# EAGLE design dp_tsc-v21 (EAGLE 6.6.0)
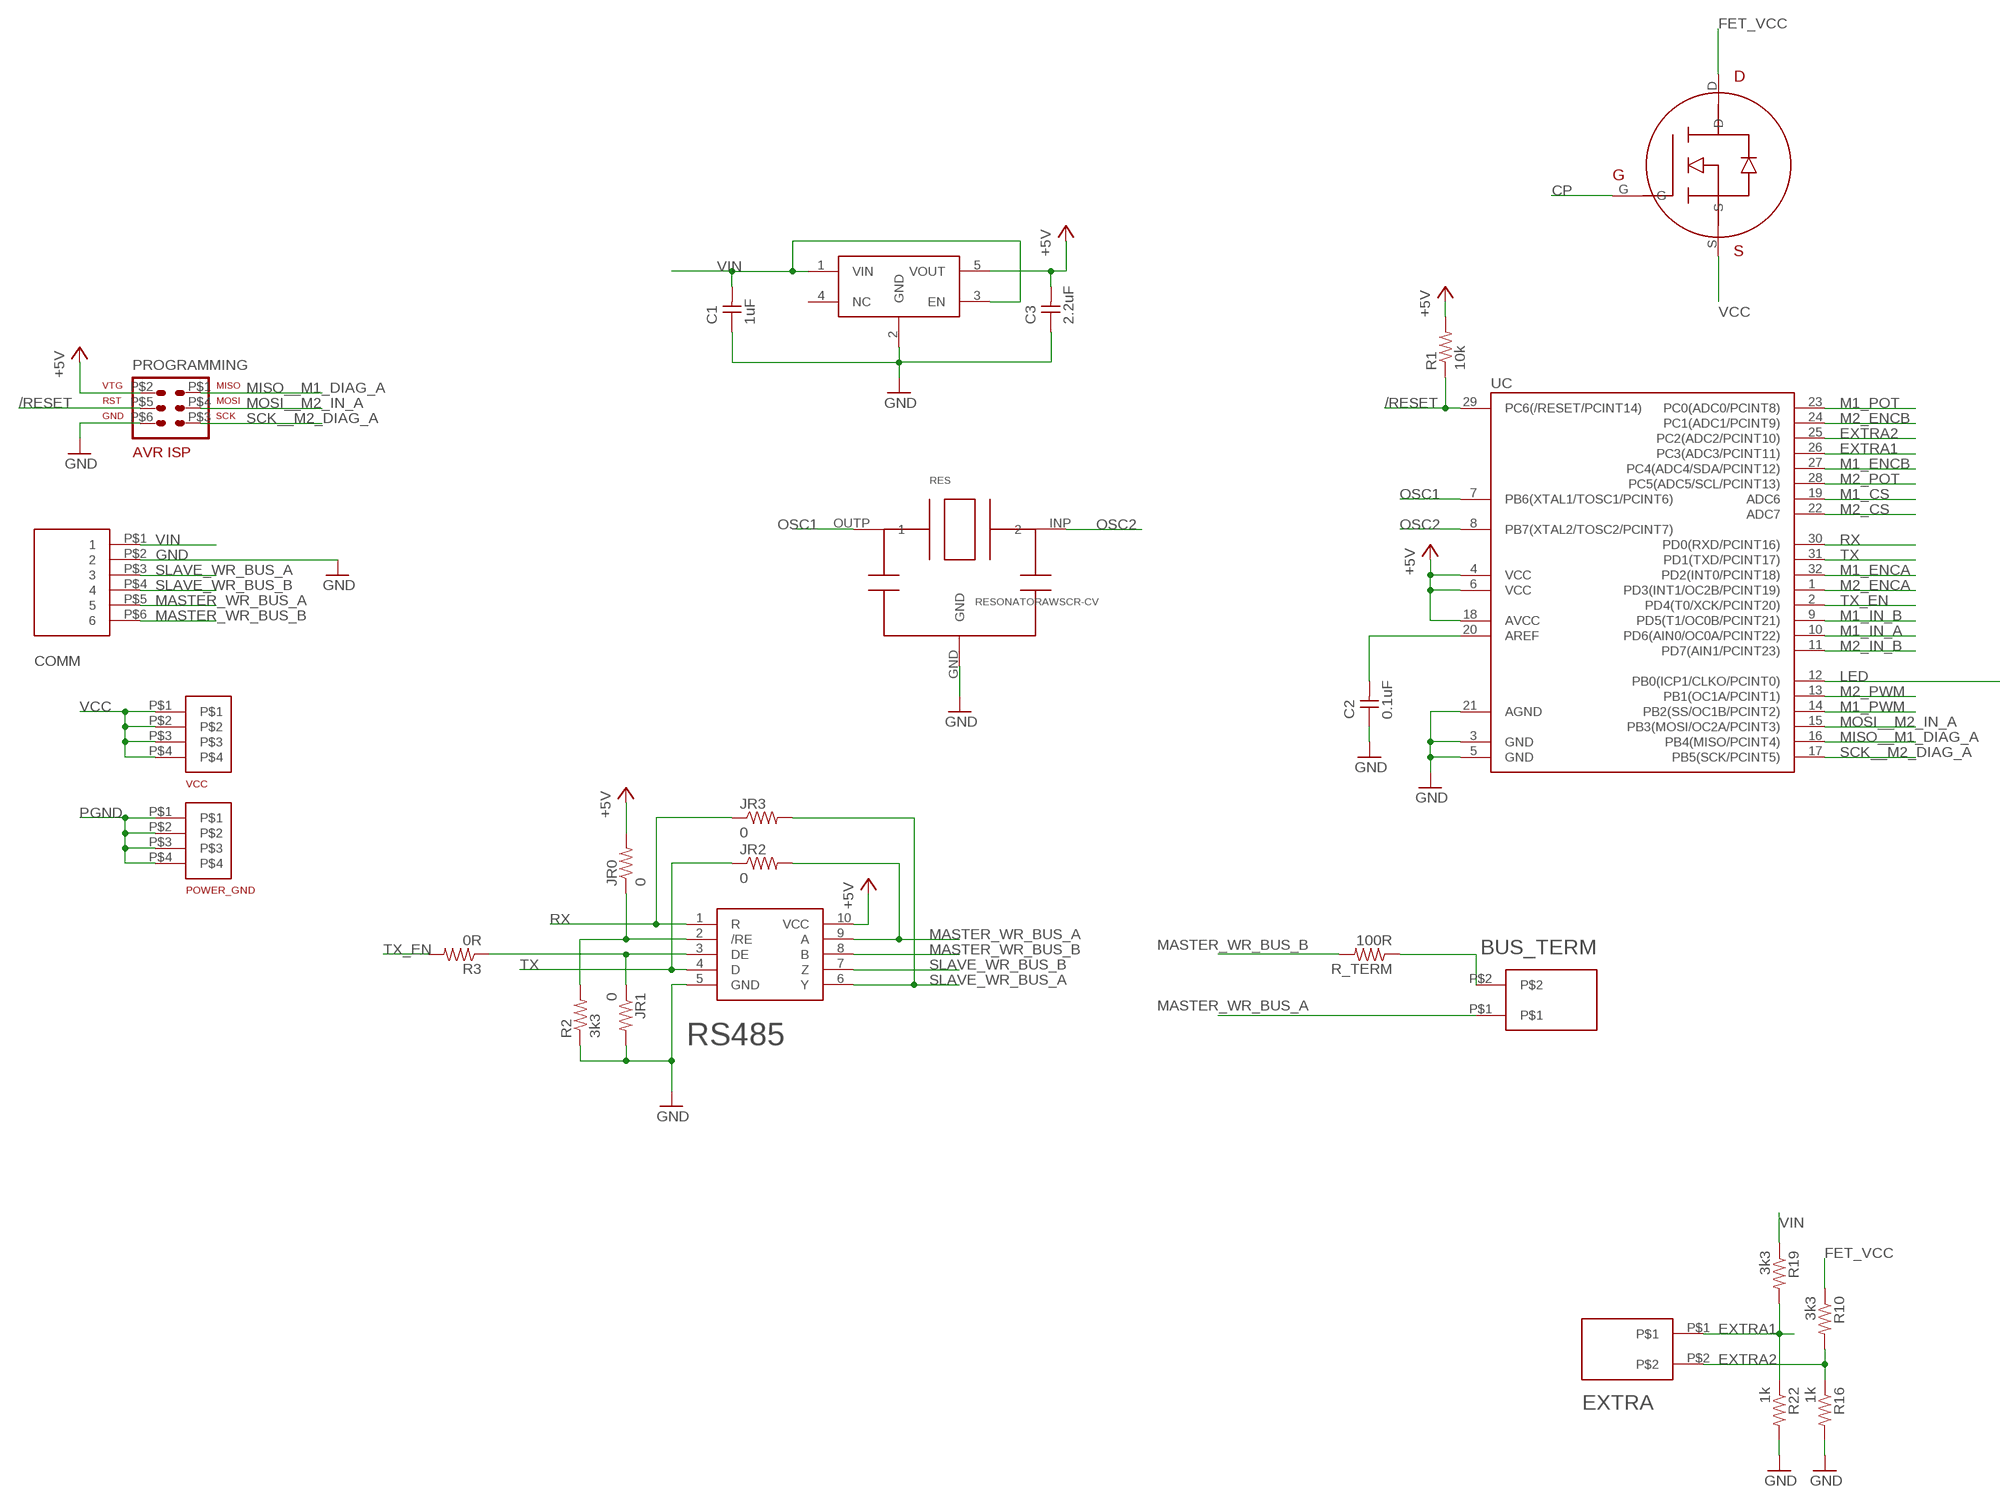
[diagram p0: schematic, sheet 1, part 1 of 2]
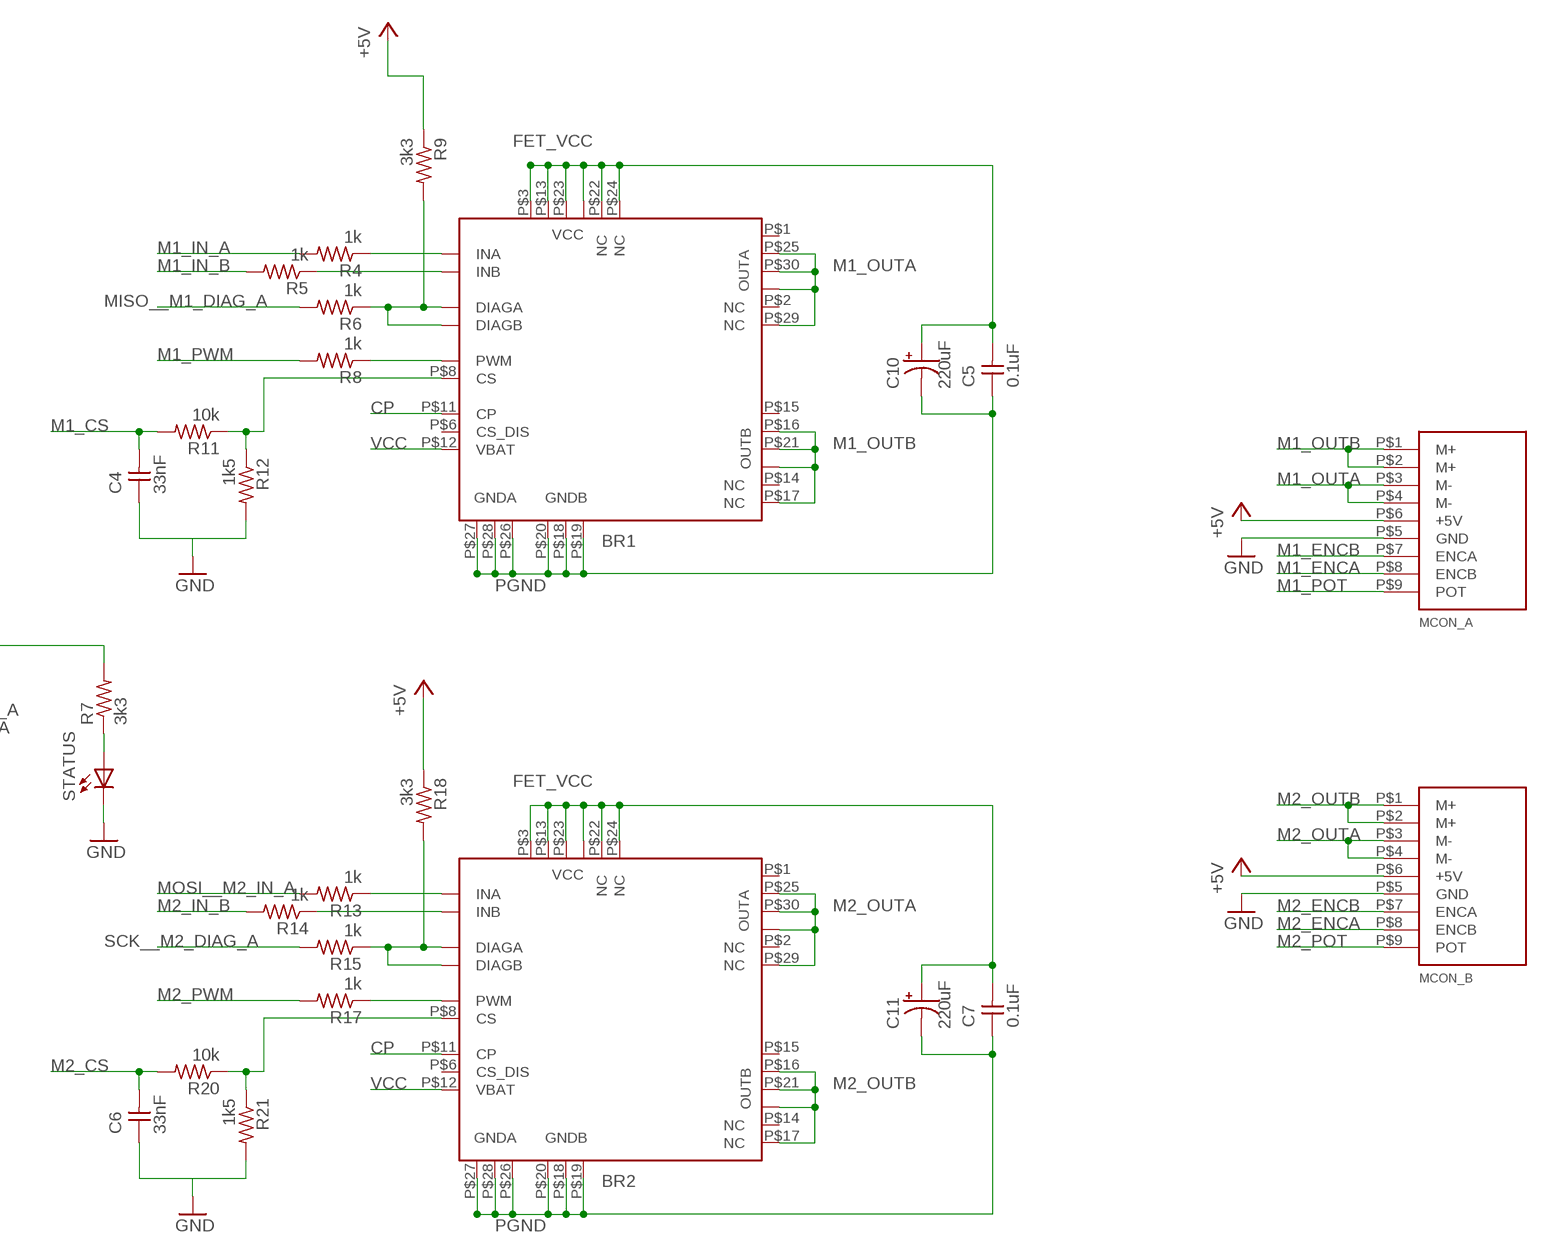
[diagram p1: schematic, sheet 1, part 2 of 2]

## Parts
BR1  VNH5019A-E  [MULTIPOWERSO-30-SIGGI]
BR2  VNH5019A-E  [MULTIPOWERSO-30-SIGGI]
BUS_TERM  2PIN-100MILL  [2-PIN-100MIL]
C1  1uF  CAPACITOR0603  [0603]
C2  0.1uF  CAPACITOR0603  [0603]
C3  2.2uF  CAPACITOR0603  [0603]
C4  33nF  CAPACITOR0603  [0603]
C5  0.1uF  CAPACITOR0603  [0603]
C6  33nF  CAPACITOR0603  [0603]
C7  0.1uF  CAPACITOR0603  [0603]
C10  220uF  CAP-EMVY350ADA221MHA0G  [HAO]
C11  220uF  CAP-EMVY350ADA221MHA0G  [HAO]
COMM  6PIN-RIBBONCABLE-BOARDHEADER  [6PIN-HEADER-DUALROW]
EXTRA  2PIN-100MILL  [2-PIN-100MIL]
FET  MOSFET-N-FDD8896  [TO-252]
JR0  0  RESISTOR0603  [0603]
JR1  0  RESISTOR0603  [0603]
JR2  0  RESISTOR0603  [0603]
JR3  0  RESISTOR0603  [0603]
MCON_A  9-PIN-MOTOR_CONNECTOR  [9-PIN-2.54MM-TERMINAL-BLOCK]
MCON_B  9-PIN-MOTOR_CONNECTOR  [9-PIN-2.54MM-TERMINAL-BLOCK]
POWER_GND  SCREW_TERMINAL_7700K  [SCREW_TERM_7700K]
PROGRAMMING  AVR-ISP-6SURFACE_MOUNT  [SMD6]
R1  10k  RESISTOR0603  [0603]
R2  3k3  RESISTOR0603  [0603]
R3  0R  RESISTOR0603  [0603]
R4  1k  RESISTOR0603  [0603]
R5  1k  RESISTOR0603  [0603]
R6  1k  RESISTOR0603  [0603]
R7  3k3  RESISTOR0603  [0603]
R8  1k  RESISTOR0603  [0603]
R9  3k3  RESISTOR0603  [0603]
R10  3k3  RESISTOR0603  [0603]
R11  10k  RESISTOR0603  [0603]
R12  1k5  RESISTOR0603  [0603]
R13  1k  RESISTOR0603  [0603]
R14  1k  RESISTOR0603  [0603]
R15  1k  RESISTOR0603  [0603]
R16  1k  RESISTOR0603  [0603]
R17  1k  RESISTOR0603  [0603]
R18  3k3  RESISTOR0603  [0603]
R19  3k3  RESISTOR0603  [0603]
R20  10k  RESISTOR0603  [0603]
R21  1k5  RESISTOR0603  [0603]
R22  1k  RESISTOR0603  [0603]
R_TERM  100R  RESISTOR0603  [0603]
RES  RESONATORAWSCR-CV  [AWSCR-CV]
RS485  RS485-SN65HVD3086EDGSR  [MSOP-10]
STATUS  LED1206  [CHIPLED_1206]
UC  MEGA48/88/168-AU  [TQFP32-08]
VCC  SCREW_TERMINAL_7700K  [SCREW_TERM_7700K]
VREG  MIC5235  [SOT-23-5]

## Nets
+1.1V: C2.2 UC.20(AREF)
+5V: C3.2 JR0.2 MCON_A.P$6(+5V) MCON_B.P$6(+5V) PROGRAMMING.P$2 R1.2 R9.1 R18.1 RS485.10(VCC) UC.4(VCC) UC.6(VCC) UC.18(AVCC) VREG.5(VOUT)
/RESET: PROGRAMMING.P$5 R1.1 UC.29(PC6(/RESET/PCINT14))
CP: BR1.P$11(CP) BR2.P$11(CP) FET.G
EXTRA1: EXTRA.P$1 R19.2 R22.1 UC.26(PC3(ADC3/PCINT11))
EXTRA2: EXTRA.P$2 R10.2 R16.1 UC.25(PC2(ADC2/PCINT10))
FET_VCC: BR1.P$3(VCC) BR1.P$13(VCC) BR1.P$22(NC) BR1.P$23(VCC) BR1.P$24(NC) BR1.VCC_SLUG(VCC) BR2.P$3(VCC) BR2.P$13(VCC) BR2.P$22(NC) BR2.P$23(VCC) BR2.P$24(NC) BR2.VCC_SLUG(VCC) C5.2 C7.2 C10.+ C11.+ FET.D R10.1
GND: C1.1 C2.1 C3.1 C4.1 C6.1 COMM.P$2 JR1.2 MCON_A.P$5(GND) MCON_B.P$5(GND) PROGRAMMING.P$6 R2.1 R12.2 R16.2 R21.2 R22.2 RES.GND RS485.5(GND) STATUS.C UC.3(GND) UC.5(GND) UC.21(AGND) VREG.2(GND)
LED: R7.2 UC.12(PB0(ICP1/CLKO/PCINT0))
M1_CS: C4.2 R11.2 UC.19(ADC6)
M1_ENCA: MCON_A.P$8(ENCB) UC.32(PD2(INT0/PCINT18))
M1_ENCB: MCON_A.P$7(ENCA) UC.27(PC4(ADC4/SDA/PCINT12))
M1_IN_A: R4.2 UC.10(PD6(AIN0/OC0A/PCINT22))
M1_IN_B: R5.2 UC.9(PD5(T1/OC0B/PCINT21))
M1_OUTA: BR1.OUTA_SLUG(OUTA) BR1.P$25(OUTA) BR1.P$29(NC) BR1.P$30(OUTA) MCON_A.P$3(M-) MCON_A.P$4(M-)
M1_OUTB: BR1.OUTB_SLUG(OUTB) BR1.P$16(OUTB) BR1.P$17(NC) BR1.P$21(OUTB) MCON_A.P$1(M+) MCON_A.P$2(M+)
M1_POT: MCON_A.P$9(POT) UC.23(PC0(ADC0/PCINT8))
M1_PWM: R8.2 UC.14(PB2(SS/OC1B/PCINT2))
M2_CS: C6.2 R20.2 UC.22(ADC7)
M2_ENCA: MCON_B.P$8(ENCB) UC.1(PD3(INT1/OC2B/PCINT19))
M2_ENCB: MCON_B.P$7(ENCA) UC.24(PC1(ADC1/PCINT9))
M2_IN_B: R14.2 UC.11(PD7(AIN1/PCINT23))
M2_OUTA: BR2.OUTA_SLUG(OUTA) BR2.P$25(OUTA) BR2.P$29(NC) BR2.P$30(OUTA) MCON_B.P$3(M-) MCON_B.P$4(M-)
M2_OUTB: BR2.OUTB_SLUG(OUTB) BR2.P$16(OUTB) BR2.P$17(NC) BR2.P$21(OUTB) MCON_B.P$1(M+) MCON_B.P$2(M+)
M2_POT: MCON_B.P$9(POT) UC.28(PC5(ADC5/SCL/PCINT13))
M2_PWM: R17.2 UC.13(PB1(OC1A/PCINT1))
MASTER_WR_BUS_A: BUS_TERM.P$1 COMM.P$5 JR2.2 RS485.9(A)
MASTER_WR_BUS_B: COMM.P$6 R_TERM.2 RS485.8(B)
MISO__M1_DIAG_A: PROGRAMMING.P$1 R6.2 UC.16(PB4(MISO/PCINT4))
MOSI__M2_IN_A: PROGRAMMING.P$4 R13.2 UC.15(PB3(MOSI/OC2A/PCINT3))
N$2: BR2.P$4(INA) R13.1
N$3: JR0.1 R2.2 RS485.2(/RE)
N$4: JR1.1 R3.1 RS485.3(DE)
N$5: BR1.P$8(CS) R11.1 R12.1
N$6: BR2.P$10(INB) R14.1
N$8: BR2.P$5(DIAGA) BR2.P$9(DIAGB) R15.1 R18.2
N$9: BR2.P$7(PWM) R17.1
N$10: BR1.P$4(INA) R4.1
N$11: BR1.P$10(INB) R5.1
N$12: R7.1 STATUS.A
N$13: BR1.P$5(DIAGA) BR1.P$9(DIAGB) R6.1 R9.2
N$14: BR1.P$7(PWM) R8.1
N$15: BR2.P$8(CS) R20.1 R21.1
N$16: BUS_TERM.P$2 R_TERM.1
OSC1: RES.OUTP UC.7(PB6(XTAL1/TOSC1/PCINT6))
OSC2: RES.INP UC.8(PB7(XTAL2/TOSC2/PCINT7))
PGND: BR1.P$18(GNDB) BR1.P$19(GNDB) BR1.P$20(GNDB) BR1.P$26(GNDA) BR1.P$27(GNDA) BR1.P$28(GNDA) BR2.P$18(GNDB) BR2.P$19(GNDB) BR2.P$20(GNDB) BR2.P$26(GNDA) BR2.P$27(GNDA) BR2.P$28(GNDA) C5.1 C7.1 C10.- C11.- POWER_GND.P$1 POWER_GND.P$2 POWER_GND.P$3 POWER_GND.P$4
RX: JR3.1 RS485.1(R) UC.30(PD0(RXD/PCINT16))
SCK__M2_DIAG_A: PROGRAMMING.P$3 R15.2 UC.17(PB5(SCK/PCINT5))
SLAVE_WR_BUS_A: COMM.P$3 JR3.2 RS485.6(Y)
SLAVE_WR_BUS_B: COMM.P$4 RS485.7(Z)
TX: JR2.1 RS485.4(D) UC.31(PD1(TXD/PCINT17))
TX_EN: R3.2 UC.2(PD4(T0/XCK/PCINT20))
VCC: BR1.P$12(VBAT) BR2.P$12(VBAT) FET.S VCC.P$1 VCC.P$2 VCC.P$3 VCC.P$4
VIN: C1.2 COMM.P$1 R19.1 VREG.1(VIN) VREG.3(EN)
Unconnected: BR1.P$1(OUTA) BR1.P$2(NC) BR1.P$6(CS_DIS) BR1.P$14(NC) BR1.P$15(OUTB) BR2.P$1(OUTA) BR2.P$2(NC) BR2.P$6(CS_DIS) BR2.P$14(NC) BR2.P$15(OUTB) VREG.4(NC)

## Library data of the parts
BR1 BR2 = st-microelectronics:VNH5019A-E
BUS_TERM EXTRA = soa:2PIN-100MILL
C1-C7 = huggable:CAPACITOR
C10 C11 = soa:CAP-EMVY350ADA221MHA0G
COMM = soa:6PIN-RIBBONCABLE-BOARDHEADER
FET = soa:MOSFET-N-FDD8896
JR0 JR1-JR3 R1-R22 R_TERM = huggable:RESISTOR
MCON_A MCON_B = soa:9-PIN-MOTOR_CONNECTOR
POWER_GND VCC = soa:SCREW_TERMINAL_7700K
PROGRAMMING = avr-4:AVR-ISP-6: AVR ISP-6 Serial Programming Header
RES = soa:RESONATOR
RS485 = soa:RS485-SN65HVD3086EDGSR
STATUS = huggable:LED
UC = avr-4:MEGA48/88/168
VREG = soa:MIC5235

## Board
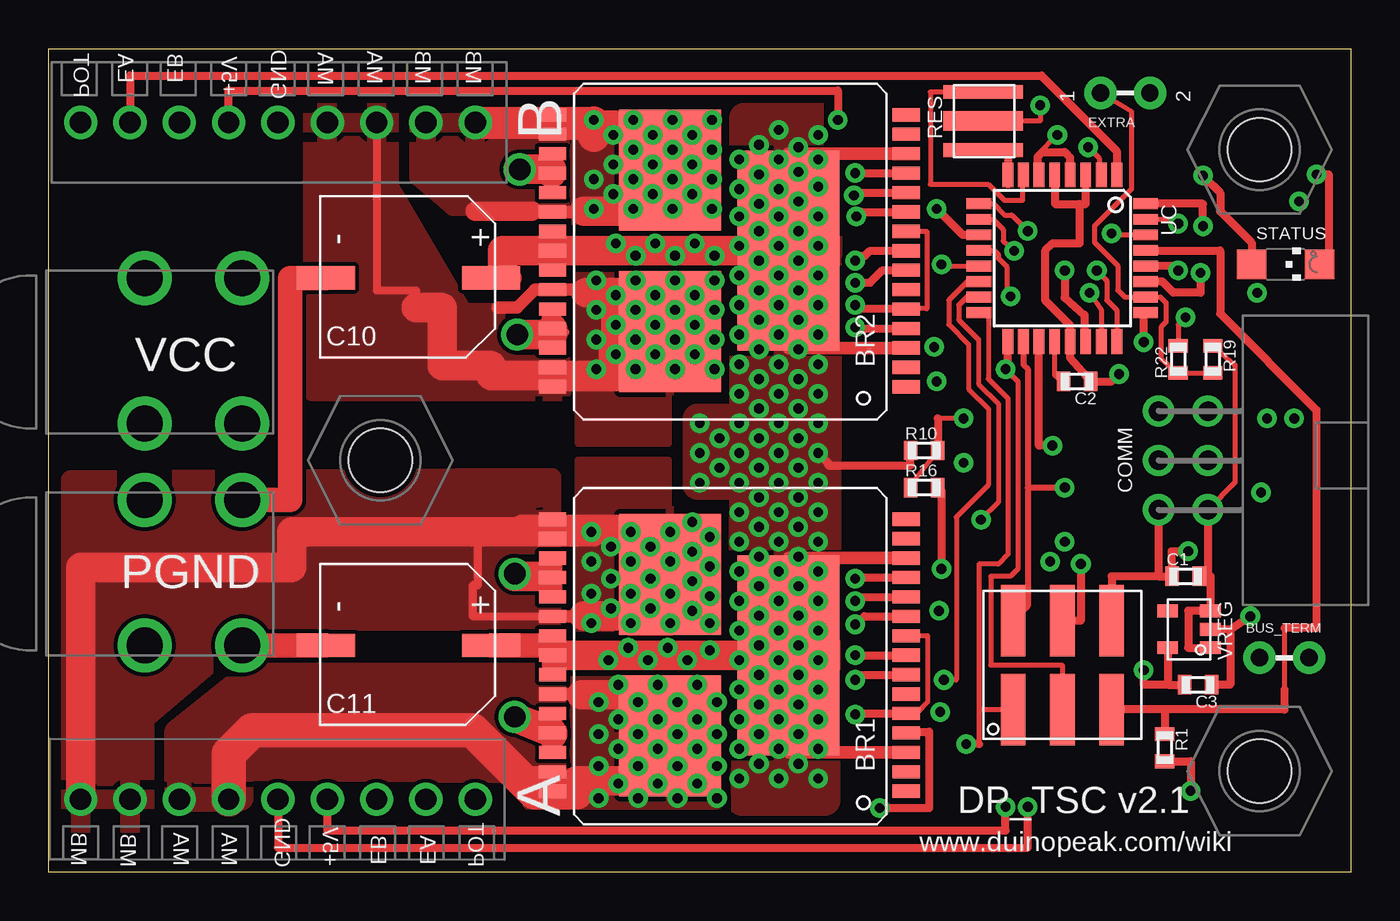
[diagram p2: board, top side]
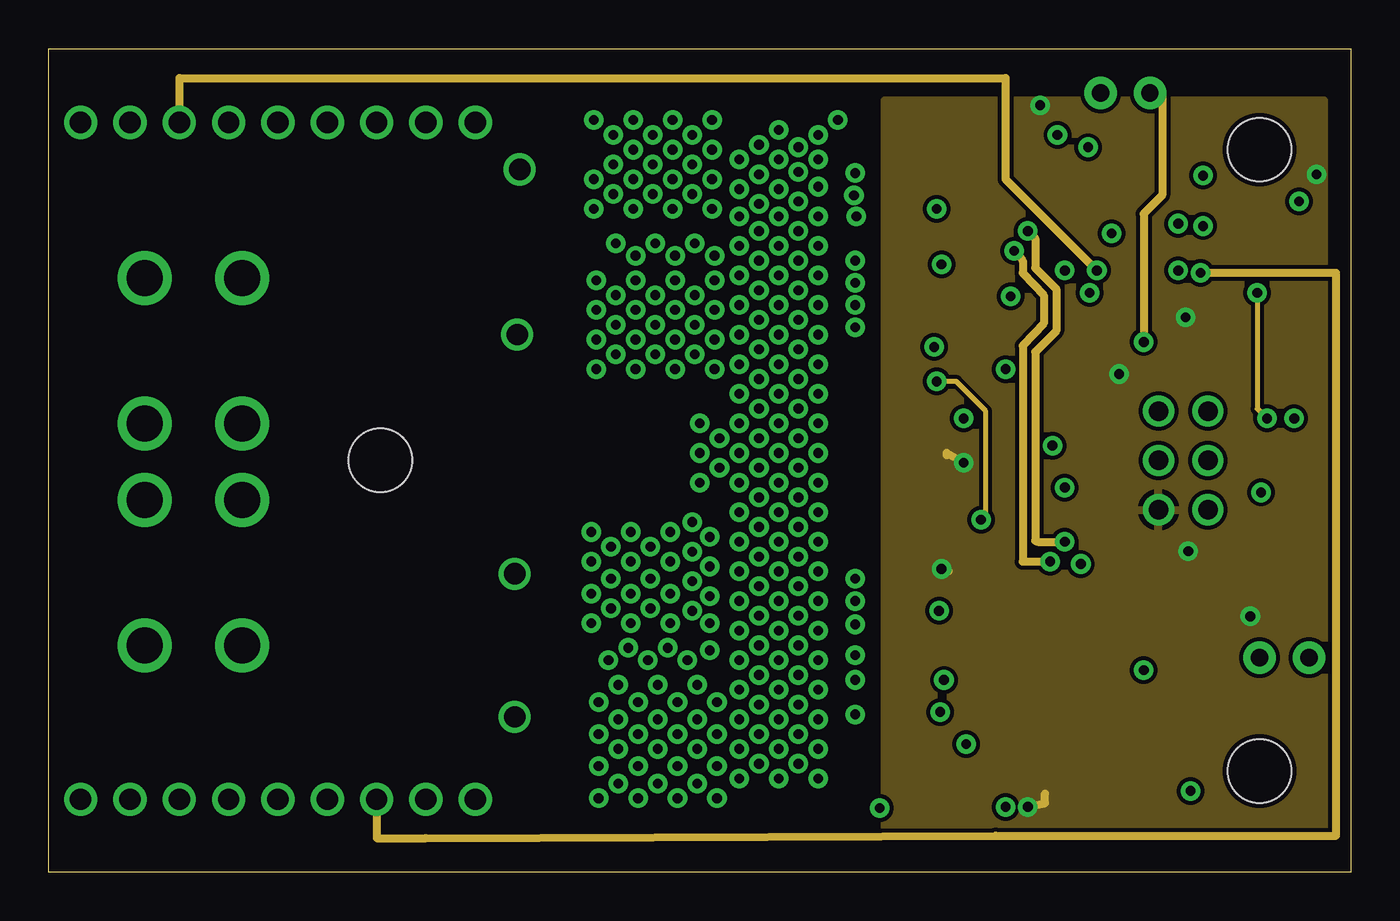
[diagram p3: board, inner layer SIGNAL]
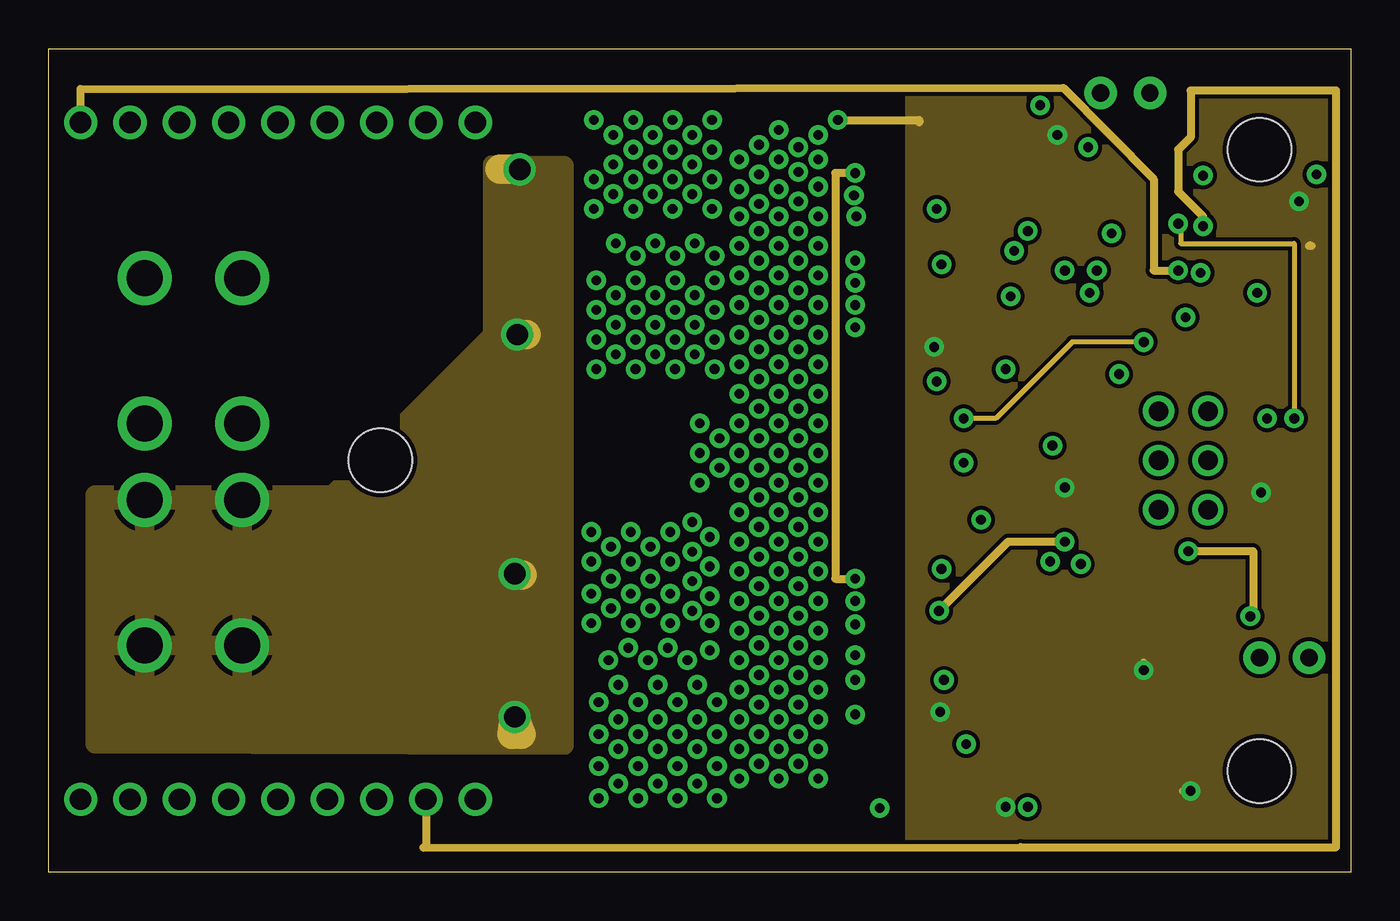
[diagram p4: board, inner layer VCC]
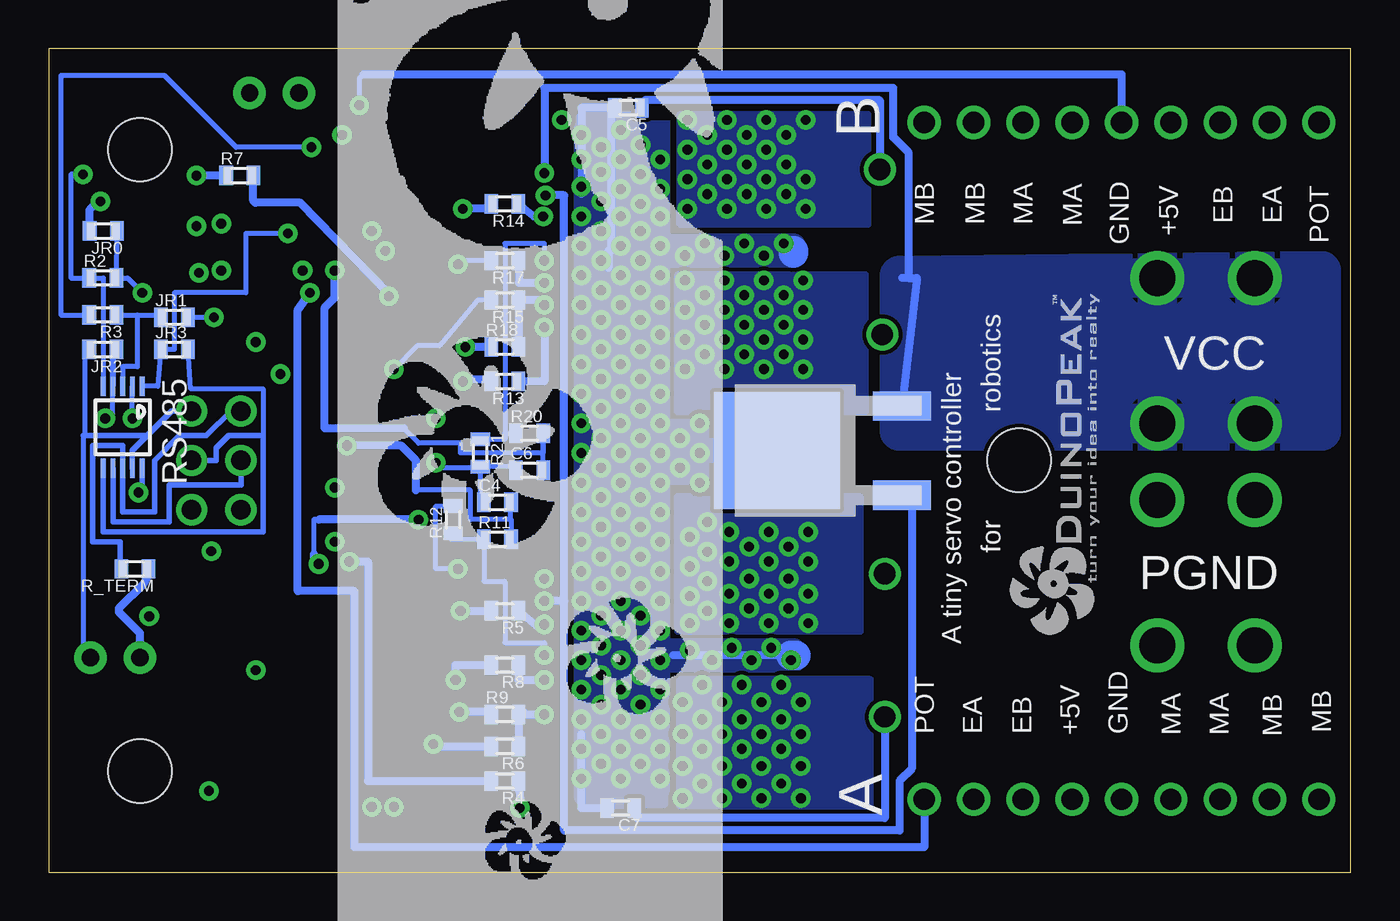
[diagram p5: board, bottom side, seen from below]

Size 67.06 x 42.42 mm. Coordinates in mm from the lower left corner, seen from the top.
Outline: 67.06,42.42 67.06,0 0,0 0,42.42 67.06,42.42
Copper layers (1*16): SIGNAL_TOP 0.035mm / dielectric 1.5mm / GND 0.035mm
Design rules "Sparkfun": minimum track width 8mil, minimum drill 20mil, track to track 8mil, track to pad 8mil, pad to pad 8mil, via to via 8mil, smd to smd 8mil, copper to edge 10mil, drill to drill 8mil, minimum pad ring 12mil, minimum via ring 10mil, stop-mask expansion 4mil, vias tented up to drill 25mil, thermal gap 10mil

### Footprints (pad centres in the part's own frame; a part is rotated, then mirrored left to right if it is on the bottom)
MULTIPOWERSO-30-SIGGI = smd 6.23 x 5.25: OUTA_SLUG -4.15,3.05; OUTB_SLUG 4.15,3.05 | smd 0.68 x 1.4: P$1 -7,-9.1; P$2 -6,-9.1; P$3 -5,-9.1; P$4 -4,-9.1; P$5 -3,-9.1; P$6 -2,-9.1; P$7 -1,-9.1; P$8 0,-9.1; P$9 1,-9.1; P$10 2,-9.1; P$11 3,-9.1; P$12 4,-9.1; P$13 5,-9.1; P$14 6,-9.1; P$15 7,-9.1; P$16 7,9.1; P$17 6,9.1; P$18 5,9.1; P$19 4,9.1; P$20 3,9.1; P$21 2,9.1; P$22 1,9.1; P$23 0,9.1; P$24 -1,9.1; P$25 -2,9.1; P$26 -3,9.1; P$27 -4,9.1; P$28 -5,9.1; P$29 -6,9.1; P$30 -7,9.1 | smd 10.3 x 5.25: VCC_SLUG 0,-3.05
2-PIN-100MIL = drill 0.889 pad 1.676: P$1 0,0; P$2 2.54,0
0603 = smd 0.7 x 1: 1 -0.7,0; 2 0.7,0
HAO = smd 1.2 x 3: + 0,5; - 0,-3.5
6PIN-HEADER-DUALROW = drill 1: P$1 -2.54,0; P$2 -2.54,2.54; P$3 0,0; P$4 0,2.54; P$5 2.54,0; P$6 2.54,2.54
TO-252 = smd 6 x 6.5: D 0,6.44 | smd 1.5 x 3: G -2.3,0; S 2.3,0
9-PIN-2.54MM-TERMINAL-BLOCK = drill 1.1: P$1 0,0; P$2 2.54,0; P$3 5.08,0; P$4 7.62,0; P$5 10.16,0; P$6 12.7,0; P$7 15.24,0; P$8 17.78,0; P$9 20.32,0
SCREW_TERM_7700K = drill 1.854: P$1 -3.81,2.032; P$2 3.683,2.032; P$3 -3.81,-2.972; P$4 3.683,-2.972
SMD6 = smd 3.68 x 1.27: P$1 -2.286,2.54; P$2 2.286,2.54; P$3 -2.286,0; P$4 2.286,0; P$5 -2.286,-2.54; P$6 2.286,-2.54
AWSCR-CV = smd 1 x 4.1: GND 0,0 | smd 0.7 x 4.1: INP -1.5,0; OUTP 1.5,0
MSOP-10 = smd 0.25 x 1: 1 -0.88,-2.423; 2 -0.38,-2.423; 3 0.12,-2.423; 4 0.62,-2.423; 5 1.12,-2.423; 6 1.12,1.803; 7 0.62,1.803; 8 0.12,1.803; 9 -0.38,1.803; 10 -0.88,1.803
CHIPLED_1206 = smd 1.5 x 1.5: A 0,-1.75; C 0,1.75
4-40_NUT_DRILL = hole 3.264: 0,0
TQFP32-08 = smd 1.27 x 0.559: 1 -4.293,2.8; 2 -4.293,2; 3 -4.293,1.2; 4 -4.293,0.4; 5 -4.293,-0.4; 6 -4.293,-1.2; 7 -4.293,-2; 8 -4.293,-2.8; 17 4.293,-2.8; 18 4.293,-2; 19 4.293,-1.2; 20 4.293,-0.4; 21 4.293,0.4; 22 4.293,1.2; 23 4.293,2; 24 4.293,2.8 | smd 0.559 x 1.27: 9 -2.8,-4.293; 10 -2,-4.293; 11 -1.2,-4.293; 12 -0.4,-4.293; 13 0.4,-4.293; 14 1.2,-4.293; 15 2,-4.293; 16 2.8,-4.293; 25 2.8,4.293; 26 2,4.293; 27 1.2,4.293; 28 0.4,4.293; 29 -0.4,4.293; 30 -1.2,4.293; 31 -2,4.293; 32 -2.8,4.293
SOT-23-5 = smd 0.65 x 1.06: 1 0,0; 2 0.95,0; 3 1.9,0; 4 1.9,2.2; 5 0,2.2

### Placement (x,y rotation side)
BR1  35.05,11.18 90 top
BR2  35.05,32 90 top
BUS_TERM  64.9,11.05 180 top
C1  58.55,15.24 0 top
C2  52.96,25.27 180 top
C3  59.18,9.65 180 top
C4  43.94,19.05 0 bottom
C5  37.21,39.37 180 bottom
C6  42.29,20.7 0 bottom
C7  37.59,3.3 180 bottom
C10  17.78,30.61 270 top
C11  17.78,11.68 270 top
COMM  59.69,21.21 90 top
EXTRA  54.17,40.13 0 top
FET  23.11,21.72 90 bottom
JR0  64.24,33.02 180 bottom
JR1  60.58,28.57 0 bottom
JR2  64.26,26.92 180 bottom
JR3  60.58,26.92 0 bottom
MCON_A  1.65,3.76 0 top
MCON_B  21.97,38.61 180 top
POWER_GND  6.99,15.49 90 top
PROGRAMMING  52.2,10.67 90 top
R1  57.47,6.41 270 top
R2  64.26,30.61 0 bottom
R3  64.26,28.7 180 bottom
R4  43.56,4.7 180 bottom
R5  43.56,13.46 180 bottom
R6  43.56,6.48 180 bottom
R7  57.21,35.88 0 bottom
R8  43.56,10.67 180 bottom
R9  43.56,8.13 0 bottom
R10  45.09,21.72 0 top
R11  43.94,17.14 0 bottom
R12  46.23,18.16 90 bottom
R13  43.56,25.27 180 bottom
R14  43.56,34.42 180 bottom
R15  43.56,29.46 180 bottom
R16  45.09,19.81 0 top
R17  43.56,31.5 180 bottom
R18  43.56,27.05 0 bottom
R19  59.94,26.42 270 top
R20  42.29,22.61 0 bottom
R21  44.83,21.59 270 bottom
R22  58.17,26.42 90 top
R_TERM  62.61,15.62 180 bottom
RES  48.12,38.68 90 top
RS485  63.12,22.61 180 bottom
STATUS  63.69,31.31 270 top
U$1  [DUINOFUN-BIG-LOGO-2.6]  32.38,-2.79 0 top
U$2  [DUINOPEAK-LOGO-0.6]  12.95,12.19 90 bottom
U$3  [4-40_NUT_DRILL]  17.09,21.21 270 top
U$10  [4-40_NUT_DRILL]  62.36,37.21 270 top
U$14  [4-40_NUT_DRILL]  62.36,5.21 270 top
UC  52.2,31.62 270 top
VCC  6.99,26.92 90 top
VREG  59.82,11.56 90 top

### Tracks (layer width: path | path; a pad name or v marks a point on that pad's centre or on a via)
+1.1V
  SIGNAL_TOP 0.254: UC.20 51.8,25.59 C2.2
+5V  (via drill 0.5)
  SIGNAL_TOP 0.254: 50.93,35.99 50.93,36.96 v51.94,37.97
  SIGNAL_TOP 0.305: PROGRAMMING.P$2 50.42,13.72 50.42,19.81 | 50.42,19.81 v52.32,19.81 | UC.18 50.2,26.13 50.42,25.91 50.42,19.81
  SIGNAL_TOP 0.406: 57.62,9.65 C3.2 | VREG.5 57.62,9.65 | MCON_A.P$6 14.35,2.16 49.28,2.16 v49.28,3.37 | MCON_B.P$6 9.27,40.26 40.64,40.26 v40.64,38.73 | UC.4 52.6,36.81 52.32,37.08 51.18,37.08 50.93,36.83 50.93,35.99 UC.6 | R1.2 58.8,5.72 v58.8,4.19 | 57.62,9.65 56.39,9.65 v56.39,10.41
  VCC 0.254: v51.94,37.97 52.32,37.97
  VCC 0.279: v62.42,19.56 62.48,19.81
  VCC 0.305: v52.32,19.81 52.32,19.56
  VCC 0.406: v45.59,27.05 45.72,27.05 | v45.91,8.26 45.85,8.26 | v58.8,4.19 58.42,4.19 | v56.39,10.41 56.39,10.79 | 65.02,32.26 64.9,32.26 | v40.64,38.73 44.83,38.73 44.83,38.61 | v49.28,3.37 49.53,3.3
  GND 0.279: RS485.10 62.24,19.56 v62.42,19.56
  GND 0.406: R18.1 v45.59,27.05 | R9.1 44.41,8.26 v45.91,8.26 | JR0.2 64.93,34.14 64.53,34.54 v64.39,34.54
  pour VCC: 66.04,40.89 66.04,1.4 44.32,1.4 44.32,40.89
/RESET
  SIGNAL_TOP 0.254: 63.63,12.57 63.63,9.4
  SIGNAL_TOP 0.406: UC.29 60.33,32.02 60.33,28.77 65.28,23.81 65.28,12.7 65.15,12.57 | 57.47,8.38 PROGRAMMING.P$5 | 57.47,8.38 R1.1 | 65.15,12.57 63.63,12.57 | 65.15,12.57 65.28,12.57 | 63.63,9.4 63.63,8.38 57.47,8.38
CP  (via drill 0.5)
  SIGNAL_TOP 0.406: 44.15,35.05 BR2.P$11 41.53,35 v41.47,34.86 | BR1.P$11 41.53,14.18 v41.53,13.97
  GND 0.406: 23.24,19.42 FET.G 22.61,19.42 22.61,5.33 23.24,4.7 23.24,2.16 40.51,2.16 40.51,13.97 | 40.51,13.97 40.51,34.86 v41.47,34.86 | 40.51,13.97 v41.53,13.97
EXTRA1
  SIGNAL_TOP 0.254: EXTRA.P$1 55.75,39.18 55.75,35.18 53.85,33.27 53.85,32.45 55.05,31.24 55.05,29.97 55.4,29.62 UC.26 57.24,29.62 57.53,29.34 57.53,28.32 57.28,28.07 57.28,26.45 R22.1 R19.2
EXTRA2  (via drill 0.5)
  SIGNAL_TOP 0.254: v47.12,23.37 45.78,23.37 | R10.2 44.38,19.94 R16.1
  SIGNAL_TOP 0.406: v56.39,27.3 56.39,28.72 UC.25 | 45.78,23.37 R10.2
  SIGNAL 0.406: v56.39,27.3 56.39,33.91 57.34,34.86 57.34,40.13 EXTRA.P$2
  VCC 0.254: 56.52,27.18 v56.39,27.3 52.7,27.3 48.77,23.37 v47.12,23.37
FET_VCC  (via drill 0.5)
  SIGNAL_TOP 0.406: v39.62,21.59 40.13,21.08 40.13,20.95 44.38,20.95 R10.1
  SIGNAL_TOP 0.508: BR2.P$24 BR2.P$23 25.78,32 | 23.37,30.61 23.37,31.24
  SIGNAL_TOP 0.635: 38.1,27 BR2.P$3 | BR2.P$13 38.1,37 BR2.VCC_SLUG | BR2.P$23 BR2.P$22 | 25.65,11.68 25.65,11.88 BR1.P$22 BR1.P$23 26.42,11.18 | BR1.P$24 25.95,10.5 25.91,10.54 | BR1.P$13 38.1,16.18 BR1.VCC_SLUG 38.1,6.18 BR1.P$3
  SIGNAL_TOP 1.016: 25.91,11.22 25.91,10.54 | 25.53,11.68 25.91,11.3 25.91,11.22 | 25.91,11.22 BR1.P$23 | C10.+ 23.37,30.61 23.88,30.61
  SIGNAL_TOP 1.27: C11.+ 25.53,11.68 25.65,11.68
  SIGNAL_TOP 1.524: 26.42,11.18 BR1.VCC_SLUG | BR2.P$23 BR2.VCC_SLUG | 25.78,32 23.37,32 23.37,31.24
  GND 0.406: 28.83,11.18 34.89,11.18 | 39.62,34.92 v39.62,35.31 v39.62,36.7 v39.62,37.97 39.62,39.37 C5.2 38.1,39.24 BR2.VCC_SLUG 38.23,32 38.23,31.11 | C7.2 39.62,3.3 v39.62,4.83 39.62,7.11
  GND 1.524: 28.83,11.18 28.57,11.18 | 28.7,32 28.7,31.88
  GND 2.54: 28.7,21.72 FET.D 28.83,21.72
  other vias: 38.61,37.34 38.61,36.07 39.62,33.78 38.61,33.02 38.61,34.54 39.62,30.73 39.62,29.21 38.61,28.45 38.61,29.97 38.61,31.5 39.62,32.26 37.59,36.7 37.59,35.18 36.58,34.42 36.58,35.94 36.58,37.47 37.59,38.23 39.62,26.16 39.62,24.64 38.61,23.88 38.61,25.4 38.61,26.92 39.62,27.69 39.62,20.07 38.61,19.3 38.61,20.83 38.61,22.35 39.62,23.11 37.59,23.11 37.59,21.59 36.58,20.83 36.58,22.35 36.58,23.88 37.59,24.64 37.59,27.69 37.59,26.16 36.58,25.4 36.58,26.92 36.58,28.45 37.59,29.21 37.59,32.26 37.59,30.73 36.58,29.97 36.58,31.5 36.58,33.02 37.59,33.78 39.62,17.02 39.62,15.49 38.61,14.73 38.61,16.26 38.61,17.78 39.62,18.54 37.59,18.54 37.59,17.02 36.58,16.26 36.58,17.78 36.58,19.3 37.59,20.07 37.59,13.97 37.59,12.45 36.58,11.68 36.58,13.21 36.58,14.73 37.59,15.49 37.59,9.4 37.59,7.87 36.58,7.11 36.58,8.64 36.58,10.16 37.59,10.92 39.62,12.45 39.62,10.92 38.61,10.16 38.61,11.68 38.61,13.21 39.62,13.97 39.62,7.87 39.62,6.35 38.61,5.59 38.61,7.11 38.61,8.64 39.62,9.4 37.59,6.35 37.59,4.83 35.56,4.83 36.58,5.59 35.56,6.35 35.56,7.87 35.56,9.4 35.56,36.7 35.56,35.18 35.56,29.21 35.56,30.73 35.56,32.26 35.56,33.78 35.56,23.11 35.56,24.64 35.56,26.16 35.56,27.69 35.56,17.02 35.56,18.54 35.56,20.07 35.56,21.59 35.56,10.92 35.56,12.45 35.56,13.97 35.56,15.49 34.29,31.75 33.27,32.38 32.26,31.75 31.24,32.38 30.23,31.75 29.21,32.38 34.54,22.35 34.54,20.83 33.53,23.11 33.53,21.59 33.53,20.07 34.04,11.43 32.89,10.92 31.88,11.56 30.86,10.92 29.84,11.56 28.83,10.92
  pour GND: 35.69,38.61 39.37,38.61 39.37,3.94 35.69,3.81 35.69,10.92 28.7,10.92 28.7,11.43 35.69,11.43 35.69,20.57 31.5,20.57 31.5,22.73 35.69,22.73 35.69,31.75 28.7,31.75 28.7,32.26 35.69,32.26
  pour SIGNAL_TOP: 40.13,38.86 40.01,3.68 35.69,3.68 35.81,19.94 33.4,19.94 33.4,23.37 35.81,23.37 35.81,38.86
GND  (via drill 0.5, 0.51)
  SIGNAL_TOP 0.254: RES.GND 51.05,38.68 v51.05,39.5 | R22.2 58.17,28.19 v58.55,28.57
  SIGNAL_TOP 0.406: C3.1 60.83,9.65 60.83,12.47 | 57.15,15.24 C1.1 57.82,16.54 v58.67,16.54 | COMM.P$2 57.15,15.24 | VREG.2 60.83,12.51 60.83,12.47 | PROGRAMMING.P$6 54.74,15.24 57.15,15.24 | 51.84,35.92 UC.5 51.82,35.92 51.82,34.42 53.09,34.42 | v61.87,13.18 60.83,12.47 | UC.21 52.58,27.33 | MCON_A.P$5 11.81,1.27 50.42,1.27 v50.42,3.37 | UC.3 53.4,34.42 53.09,34.42 | UC.21 52.6,28.18 51.31,29.46 51.31,32 51.69,32.38 53.09,32.38 53.09,34.42 | v55.12,25.65 54.74,25.27 C2.1 52.6,26.48 UC.21 | 65.28,35.88 v65.28,35.94 65.91,35.94 65.91,31.3 STATUS.C | R16.2 45.97,19.62 v45.97,15.62
  SIGNAL 0.254: v55.12,25.65 55.12,25.78 55.24,25.91 | v58.55,28.57 58.55,28.32 | v65.28,35.94 65.15,35.94
  SIGNAL 0.406: v50.42,3.37 51.31,3.56 51.31,4.06 | v47.12,21.08 46.23,21.59 46.23,21.46 | v45.97,15.62 46.1,15.49 46.35,15.49
  VCC 0.406: v58.67,16.54 62.03,16.54 62.03,13.16 61.82,13.16 v61.87,13.18
  GND 0.254: RS485.5 64.24,30.61 R2.1 65.91,30.61 65.91,35.94 v65.28,35.94 | v58.55,28.57 JR1.2 | 50.85,41.07 51.05,40.87 v51.05,39.5 | C6.1 42.99,20.89 R21.2 | C4.1 44.83,19.05 44.83,20.83 47.12,20.83 v47.12,21.08 | R12.2 47.12,18.86 47.12,15.62 v45.97,15.62
  GND 0.406: MCON_B.P$5 11.81,41.07 50.85,41.07 | R21.2 44.83,20.83
  pour SIGNAL: 43.05,39.75 65.66,39.75 65.66,1.78 43.05,1.78
LED  (via drill 0.5)
  SIGNAL_TOP 0.254: UC.12 48.69,32.02 48.9,31.81 48.9,31.62 49.34,31.18 49.34,29.84 v49.53,29.65
  GND 0.406: v49.53,29.65 49.53,29.78 54.1,34.48 56.41,34.48 56.52,34.58 R7.2
M1_CS  (via drill 0.5)
  SIGNAL_TOP 0.406: v51.69,21.97 51,21.97 UC.19
  GND 0.254: 48.13,19.68 45.34,19.68 45.34,18.16 43.31,18.16 | 43.31,18.16 43.31,19.05 C4.2 | R11.2 43.24,18.16 43.31,18.16
  GND 0.406: v51.69,21.97 48.9,21.97 48.13,21.21 48.13,19.68
M1_ENCA  (via drill 0.5)
  SIGNAL_TOP 0.406: v59.44,33.27 59.44,34.42 UC.32
  VCC 0.254: v59.44,33.27 59.44,33.59
  VCC 0.406: MCON_A.P$8 19.43,1.27 19.3,1.27 50.04,1.29 66.29,1.29 66.29,40.26 58.8,40.26 58.8,37.85 58.17,37.21 58.17,35.05 59.44,33.78 v59.44,33.27
M1_ENCB  (via drill 0.5)
  SIGNAL_TOP 0.406: v59.31,30.86 59.31,29.84 57.91,29.84 57.33,30.42 UC.27
  SIGNAL 0.406: v59.31,30.86 66.29,30.86 66.29,1.88 48.77,1.88 19.43,1.75 16.89,1.75 MCON_A.P$7
M1_IN_A  (via drill 0.5)
  SIGNAL_TOP 0.254: UC.10 48.61,33.62 49.15,33.08 49.15,32.51 v49.72,32
  SIGNAL 0.406: v49.72,32 50.16,31.5 50.16,30.86 51.24,29.72 51.24,28.26 50.16,27.11 50.16,16 v51.56,16
  GND 0.406: R4.2 50.61,4.7 50.61,16 v51.56,16
M1_IN_B  (via drill 0.5)
  SIGNAL_TOP 0.254: UC.9 48.63,34.42 49.21,33.85 49.59,33.85 v50.42,33.02
  SIGNAL 0.406: v50.42,33.02 50.8,32.64 50.8,31.11 51.88,30.04 51.88,27.88 50.8,26.8 50.8,17.08 50.93,17.02 v52.32,17.02
  VCC 0.406: v45.85,13.46 49.4,17.02 v52.32,17.02
  GND 0.406: v45.85,13.46 R5.2
M1_OUTA  (via drill 0.5)
  SIGNAL_TOP 0.508: BR1.P$29 25.95,4.7 27.18,4.7
  SIGNAL_TOP 0.635: BR1.P$25 27.43,9.18 27.43,9.14
  SIGNAL_TOP 1.016: BR1.P$30 25.95,4.7 25.95,4.91 25.91,4.95 24.38,4.95
  SIGNAL_TOP 1.524: 27.43,9.14 32,9.14 BR1.OUTA_SLUG 32,4.7 27.18,4.7
  SIGNAL_TOP 1.778: MCON_A.P$4 9.27,6.1 10.48,7.3 21.84,7.3 25.02,4.13 27.18,4.13
  other vias: 34.42,5.46 34.42,3.81 33.4,4.57 33.4,6.35 30.35,8.76 30.35,7.11 29.34,7.87 29.34,9.65 28.32,8.76 28.32,7.11 28.32,5.46 28.32,3.81 30.35,5.46 30.35,3.81 29.34,4.57 29.34,6.35 32.38,5.46 32.38,3.81 31.37,4.57 31.37,6.35 32.38,8.76 32.38,7.11 31.37,7.87 31.37,9.65 34.42,8.76 34.42,7.11 33.4,7.87 33.4,9.65
  pour SIGNAL_TOP: 6.6,7.24 10.29,10.16 26.04,10.16 26.04,5.21 9.91,5.33 9.91,3.81 6.6,3.68
  pour GND: 34.54,9.91 34.54,3.43 24.77,3.43 24.77,9.91
  pour SIGNAL_TOP: 34.42,9.91 34.42,3.43 24.64,3.43 24.64,9.91
M1_OUTB  (via drill 0.5)
  SIGNAL_TOP 0.406: BR1.P$21 21.84,13.18 21.84,14.8 22.1,14.8 22.1,17.65 24.38,17.65
  SIGNAL_TOP 0.508: BR1.P$16 BR1.P$17 25.95,17.65 26.8,17.65
  SIGNAL_TOP 0.635: BR1.P$21 27.3,13.18 27.56,13.21
  SIGNAL_TOP 1.524: 26.8,17.65 32,17.65 BR1.OUTB_SLUG 32,12.95 29.97,12.95 29.97,13.21 27.56,13.21 | 24.38,17.65 28,17.65 28,17.53 12.51,17.53 12.51,15.68 1.65,15.68 MCON_A.P$1
  other vias: 34.04,14.22 34.04,12.83 33.15,13.46 33.15,14.99 34.04,17.27 34.04,15.75 33.15,16.51 33.15,18.03 32,17.53 32,16 30.99,16.76 32,14.35 32,12.83 30.99,13.59 30.99,15.11 29.97,14.35 29.97,12.83 28.96,13.59 28.96,15.11 29.97,17.53 29.97,16 28.96,16.76 27.94,16 27.94,14.35 27.94,12.83 27.94,17.53
  pour SIGNAL_TOP: 4.95,2.54 4.95,7.87 10.92,12.95 25.91,12.95 25.91,20.32 1.14,20.19 1.14,2.54
  pour SIGNAL_TOP: 34.42,18.67 34.42,12.57 27.3,12.57 27.3,21.21 31.88,21.21 31.88,18.67
  pour GND: 34.67,19.3 34.67,12.45 25.27,12.45 25.27,19.3
M1_POT  (via drill 0.5)
  SIGNAL_TOP 0.254: v53.59,29.84 54.2,28.99 UC.23
  GND 0.381: 42.29,1.29 42.16,1.29
  GND 0.406: MCON_A.P$9 21.97,1.29 42.29,1.29 51.31,1.29 51.31,14.48 54.23,14.48 54.23,28.96 v53.59,29.84
M1_PWM  (via drill 0.5)
  SIGNAL_TOP 0.254: UC.14 47.31,30.42 46.35,29.46 46.35,28.19 47.37,27.18 47.37,24.89 48.39,23.88 48.39,19.94 46.74,18.29 46.74,9.91 v46.1,9.91
  GND 0.406: R8.2 46.1,10.67 v46.1,9.91
M2_CS  (via drill 0.5)
  SIGNAL_TOP 0.406: v52.32,30.99 52.32,29.59 53.34,28.7 53.34,27.39 UC.22
  GND 0.254: 48.77,22.86 48.01,22.1 45.85,22.1 45.85,21.59 41.59,21.59 R20.2 C6.2
  GND 0.406: v52.32,30.99 52.32,29.59 52.83,29.08 52.83,22.86 48.77,22.86
M2_ENCA
  SIGNAL_TOP 0.406: MCON_B.P$8 4.19,41.02 51.12,41.02 55,37.14 UC.1
M2_ENCB  (via drill 0.5)
  SIGNAL_TOP 0.254: v53.98,30.99 54.48,30.48 54.48,29.46 55,28.95 UC.24
  SIGNAL 0.406: v53.98,30.99 49.28,35.69 49.28,40.89 6.73,40.89 MCON_B.P$7
M2_IN_B  (via drill 0.5)
  SIGNAL_TOP 0.406: v45.72,34.16 47.06,32.82 UC.11
  GND 0.406: R14.2 44.41,34.16 v45.72,34.16
M2_OUTA  (via drill 0.5)
  SIGNAL_TOP 0.406: 26.04,25.53 26.04,26 BR2.P$29 BR2.P$30 | 18.92,29.08 18.92,29.97 16.89,29.97 MCON_B.P$3
  SIGNAL_TOP 0.635: 27.69,29.84 arc90 27.53,30 BR2.P$25 25.05,30 24.13,29.08 23.11,29.08
  SIGNAL_TOP 1.524: 27.69,29.84 30.01,29.84 arc-90 BR2.OUTA_SLUG 32,25.53 26.04,25.53 | 18.92,29.08 20.26,29.08 20.26,26.1 22.8,26.1 22.8,25.59 29.08,25.59 29.08,27.43 29.21,27.43 v29.21,29.72
  other vias: 34.29,30.48 34.29,28.96 33.27,29.72 30.23,30.48 30.23,28.96 28.19,28.96 28.19,30.48 28.19,25.91 30.23,25.91 32.26,25.91 34.29,25.91 34.29,27.43 33.27,28.19 33.27,26.67 32.26,27.43 32.26,30.48 32.26,28.96 31.24,29.72 31.24,28.19 31.24,26.67 30.23,27.43 29.21,28.19 29.21,26.67 28.19,27.43
  pour SIGNAL_TOP: 17.53,39.12 17.53,35.31 21.34,28.83 26.29,28.83 26.42,24.77 13.59,24.77 13.59,39.12
  pour SIGNAL_TOP: 27.3,30.73 34.42,30.73 34.42,24.77 31.88,24.77 31.88,22.1 27.3,22.1
  pour GND: 34.67,30.73 34.67,23.75 25.02,23.75 25.02,30.73
M2_OUTB  (via drill 0.5)
  SIGNAL_TOP 0.406: BR2.P$17 arc90 26.04,38.09 26.04,38.48 | BR2.P$16 arc-90 26.29,38.67 26.54,38.48 | 28.07,37.91 v28.07,38.73
  SIGNAL_TOP 0.508: 24.89,34.04 24.89,34 BR2.P$21
  SIGNAL_TOP 0.635: BR2.P$21 27.53,34 arc90 27.56,34.04
  SIGNAL_TOP 1.016: 24.89,34.04 21.97,34.04
  SIGNAL_TOP 1.524: 26.04,38.48 26.54,38.48 29.68,38.48 arc-90 BR2.OUTB_SLUG arc-90 29.88,34.04 27.56,34.04
  SIGNAL_TOP 1.651: MCON_B.P$1 28.07,38.61 28.07,37.91
  other vias: 34.16,38.73 34.16,37.21 33.15,37.97 33.15,36.45 34.16,35.69 33.15,34.92 34.16,34.16 32.13,34.16 32.13,35.69 32.13,37.21 32.13,38.73 31.11,37.97 31.11,36.45 31.11,34.92 30.1,34.16 30.1,35.69 30.1,37.21 30.1,38.73 29.08,37.97 29.08,36.45 29.08,34.92 28.07,34.16 28.07,35.69
  pour SIGNAL_TOP: 19.08,38.58 26.34,38.71 26.34,34.26 20.83,34.29 19.08,35.79
  pour SIGNAL_TOP: 26.42,38.73 34.42,38.73 34.42,33.53 26.42,33.53
  pour GND: 34.54,38.99 34.54,33.4 24.89,33.4 24.89,38.99
M2_POT  (via drill 0.5)
  SIGNAL_TOP 0.406: v58.17,30.99 58.17,31.22 UC.28
  VCC 0.406: MCON_B.P$9 1.65,40.34 52.25,40.4 56.9,35.69 56.9,30.99 v58.17,30.99
M2_PWM  (via drill 0.5)
  SIGNAL_TOP 0.254: UC.13 46.06,31.22 v45.97,31.3
  GND 0.254: R17.2 45.91,31.5 v45.97,31.3
MASTER_WR_BUS_A
  GND 0.254: 65.17,22.48 65.17,26.92 JR2.2 | 65.28,22.48 65.28,11.05
  GND 0.279: COMM.P$5 60.71,23.75 61.98,22.48 | 61.98,22.48 62.74,21.72 RS485.9 | 61.98,22.48 65.17,22.48 65.28,22.48
  GND 0.406: 65.28,11.05 BUS_TERM.P$1
MASTER_WR_BUS_B
  GND 0.279: 63.37,15.37 63.37,17.02 64.77,17.02 64.77,21.97 63.24,21.97 RS485.8 63.24,18.54 61.59,18.54 61.59,21.21 60.33,22.48 58.93,22.48 57.66,23.75 COMM.P$6
  GND 0.406: 63.37,15.37 R_TERM.2
MISO__M1_DIAG_A  (via drill 0.5)
  SIGNAL_TOP 0.254: UC.16 48.39,28.82 48.39,25.4 49.4,24.38 49.4,16.38 48.9,15.88 47.9,15.88 47.9,8.38 | 47.9,8.38 47.9,6.6 | 47.9,8.38 PROGRAMMING.P$1
  SIGNAL_TOP 0.406: 47.9,6.6 v47.24,6.6
  GND 0.406: v47.24,6.6 47.24,6.48 R6.2
MOSI__M2_IN_A  (via drill 0.5)
  SIGNAL_TOP 0.254: UC.15 47.28,29.62 46.86,29.21 46.86,28.45 47.88,27.43 47.88,25.15 48.9,24.13 48.9,19.05 v48.01,18.16
  SIGNAL_TOP 0.406: v48.01,18.16 48.26,18.16 | v53.15,15.88 53.15,12.95 PROGRAMMING.P$4
  SIGNAL 0.254: v45.72,25.27 46.74,25.27 48.26,23.75 48.26,18.41 v48.01,18.16
  GND 0.254: 53.15,18.16 53.4,18.16 53.4,16.38
  GND 0.406: v48.01,18.16 53.15,18.16 | 53.4,16.38 53.4,16.13 v53.15,15.88 | R13.2 44.41,25.4 45.59,25.4 v45.72,25.27
N$2  (via drill 0.5)
  SIGNAL_TOP 0.406: 44.15,27.94 BR2.P$4 41.53,28 v41.53,28.07
  GND 0.406: v41.53,28.07 41.53,25.27 R13.1
N$3  (via drill 0.5)
  SIGNAL 0.254: v62.74,23.37 62.23,23.88 v62.23,29.84
  GND 0.254: JR0.1 R2.2 62.99,30.61 v62.23,29.84 | RS485.2 v62.74,23.37
N$4
  GND 0.254: RS485.3 63.24,26.04 62.48,26.04 62.48,28.7 | R3.1 62.48,28.7 | JR1.1 61.43,28.7 62.48,28.7
N$5  (via drill 0.5)
  SIGNAL_TOP 0.406: v41.53,11.18 BR1.P$8
  GND 0.254: v41.53,11.18 41.53,11.81 43.56,11.81 43.56,14.99 44.64,14.99 R11.1 46.35,17.14 R12.1
N$6  (via drill 0.5)
  SIGNAL_TOP 0.406: BR2.P$10 41.88,34 v41.59,33.78
  GND 0.406: v41.59,33.78 42.08,33.78 R14.1
N$8  (via drill 0.5)
  SIGNAL_TOP 0.254: BR2.P$9 45.21,33 45.21,29.02 44.15,29.02 BR2.P$5
  SIGNAL_TOP 0.406: BR2.P$5 44.15,28.96 | BR2.P$5 44.15,29.08 | BR2.P$5 41.53,29 v41.53,29.21
  GND 0.406: R18.2 R15.1 41.53,29.46 v41.53,29.21
N$9  (via drill 0.5)
  SIGNAL_TOP 0.406: BR2.P$7 42.94,31 42.29,30.35 v41.53,30.35
  GND 0.406: R17.1 42.84,30.35 v41.53,30.35
N$10  (via drill 0.5)
  SIGNAL_TOP 0.406: v42.8,3.3 45.34,3.3 45.34,7.24 44.15,7.24 BR1.P$4
  GND 0.406: R4.1 42.71,3.3 v42.8,3.3
N$11  (via drill 0.5)
  SIGNAL_TOP 0.406: BR1.P$10 42.01,13.18 v41.53,12.76
  GND 0.406: v41.53,12.76 41.95,12.7 R5.1
N$12  (via drill 0.5)
  SIGNAL_TOP 0.406: v59.44,35.88 60.33,34.99 60.33,34.04 61.94,32.42 STATUS.A
  GND 0.406: R7.1 v59.44,35.88
N$13  (via drill 0.5)
  SIGNAL_TOP 0.254: BR1.P$9 45.28,12.18 45.28,8.76 44.7,8.19 44.17,8.19 BR1.P$5
  SIGNAL_TOP 0.406: BR1.P$5 41.53,8.18 v41.53,8.13
  GND 0.406: R9.2 R6.1 | R9.2 42.58,8.26 | R9.2 v41.53,8.13
N$14  (via drill 0.5)
  SIGNAL_TOP 0.406: BR1.P$7 41.53,10.18 v41.53,9.91
  GND 0.406: R8.1 42.86,9.91 v41.53,9.91
N$15  (via drill 0.5)
  SIGNAL_TOP 0.406: BR2.P$8 42.29,32 42.04,31.75 41.78,31.75 v41.53,31.5
  GND 0.254: v41.53,31.5 41.53,32.38 43.56,32.38 43.56,22.61 | 43.56,22.61 R20.1 | 43.56,22.61 43.56,22.29 R21.1
N$16
  GND 0.406: BUS_TERM.P$2 62.36,12.32 63.44,13.4 63.44,13.59 62.17,14.86 arc-34 R_TERM.1
OSC1
  SIGNAL_TOP 0.254: 50.16,35.95 50.16,34.61 49.21,34.61 48.39,35.43 45.4,35.43 45.4,40.18 RES.OUTP
  SIGNAL_TOP 0.406: 50.16,35.92 UC.7 50.16,35.95
OSC2
  SIGNAL_TOP 0.406: 49.4,35.43 UC.8 49.4,36.93 RES.INP
PGND  (via drill 1.1)
  SIGNAL_TOP 0.406: BR2.P$28 25.95,27.43 25.91,27.43 | 25.4,15.24 25.95,15.24
  SIGNAL_TOP 0.508: BR2.P$26 25.95,28.57 25.91,28.57 | BR2.P$18 25.95,36.58 25.91,36.58 | 26.04,35.43 25.95,35.43 BR2.P$20 BR2.P$19 25.95,36.2 | 25.91,15.75 25.91,16.18 BR1.P$18 25.95,15.24 | BR1.P$20 25.91,14.18 25.91,14.61 | BR1.P$26 25.91,8.18 25.91,7.75 | BR1.P$28 25.91,6.18 25.91,6.6 | 25.95,27.81 26.54,27.81
  SIGNAL_TOP 1.016: 25.91,28 25.91,27.43 | 25.91,28 25.91,28.57 | BR2.P$27 25.91,28 | 25.91,36.58 25.91,36 BR2.P$19 26.04,36 | 25.91,15.75 25.95,15.75 25.95,15.24 BR1.P$19 25.95,14.61 25.91,14.61 | 25.91,7.75 25.95,7.75 BR1.P$27 25.95,6.6 25.91,6.6
  SIGNAL_TOP 1.27: POWER_GND.P$3 C11.- | C10.- 12.45,30.61 12.45,19.18 POWER_GND.P$4
  SIGNAL_TOP 1.524: BR2.P$27 25.95,27.81 25.95,27.69 v24.13,27.69 | 25.95,7.11 BR1.P$27 23.94,8 v24,8 | 25.91,36 25.91,36.2 v24.26,36.2 | 25.4,15.24 24,15.24 v24,15.37
  VCC 1.524: v24.26,36.2 23.24,36.2 | v24.13,27.69 24.57,27.69 | v24,15.37 24.38,15.3 | 24.32,7.11 v24,8 23.88,7.11
  GND 0.406: v24.26,36.2 24.26,39.75 36.36,39.75 C5.1 | C7.1 36.74,2.79 24,2.79 v24,8
  pour VCC: 2.41,19.43 14.61,19.43 22.86,27.69 22.86,36.45 26.54,36.39 26.54,6.54 2.41,6.6
RX  (via drill 0.5)
  SIGNAL_TOP 0.254: v54.74,32.89 54.74,32.82 UC.30
  GND 0.254: RS485.1 61.43,25.03 JR3.1 60.58,26.92 60.58,29.84 56.9,29.84 56.9,32.89 v54.74,32.89
SCK__M2_DIAG_A  (via drill 0.5)
  SIGNAL_TOP 0.254: v49.28,25.91 49.91,25.27 49.91,15.62 49.53,15.24 48.51,15.24 48.51,10.67 52.2,10.67 PROGRAMMING.P$3
  SIGNAL_TOP 0.406: UC.17 49.4,25.91 v49.28,25.91 49.53,25.91
  GND 0.254: 44.41,29.46 44.96,29.46 46.93,27.11 48.07,27.11 v49.28,25.91
  GND 0.406: R15.2 44.41,29.46 | v49.28,25.91 49.4,25.78
SLAVE_WR_BUS_A
  GND 0.254: JR3.2 59.73,24.89 56.01,24.89 56.01,22.48
  GND 0.279: RS485.6 64.24,17.53 56.01,17.53 56.01,22.48 57.78,22.48 58.42,21.84 58.42,21.21 COMM.P$3
SLAVE_WR_BUS_B
  GND 0.279: RS485.7 63.74,18.03 60.83,18.03 60.83,19.94 57.15,19.94 COMM.P$4
TX  (via drill 0.5)
  SIGNAL_TOP 0.254: v58.17,33.4 58.17,33.62 UC.31
  VCC 0.254: v64.14,23.37 64.14,32.38 58.29,32.38 58.29,33.4 v58.17,33.4
  GND 0.254: RS485.4 63.74,26.92 JR2.1 63.75,26.58 63.75,23.37 v64.14,23.37
TX_EN  (via drill 0.5)
  SIGNAL_TOP 0.254: UC.2 54.1,36.01 54.1,36.77 v53.53,37.34
  GND 0.254: R3.2 66.42,28.7 66.42,41.02 61.09,41.02 57.4,37.34 v53.53,37.34
VCC  (via drill 0.5)
  SIGNAL_TOP 0.406: BR2.P$12 41.66,36 v41.53,36.01 | BR1.P$12 41.53,15.18 v41.53,15.11
  VCC 0.406: v41.53,15.11 40.51,15.11 40.51,36.01 v41.53,36.01
  GND 0.406: 22.8,30.61 22.35,30.61 FET.S | 22.8,30.61 23.11,30.61 | v41.53,36.01 41.53,40.39 23.56,40.39 23.56,37.85 22.8,37.08 22.8,30.61
  pour GND: 23.24,30.73 23.24,22.73 1.52,22.73 1.52,30.99
VIN
  SIGNAL_TOP 0.254: R19.1 61.09,26.12 61.09,20.07 COMM.P$1
  SIGNAL_TOP 0.406: 59.69,15.24 C1.2 | VREG.1 58.67,11.56 58.67,13.46 VREG.3 59.82,15.24 59.69,15.24 | COMM.P$1 59.69,15.24

### Text on the board
tPlace: EA | EB | MA | MA | MB | MB | POT | +5V | GND | B | 1 | 2 | VCC | PGND | A | DP_TSC v2.1 | www.duinopeak.com/wiki | MB | MB | MA | MA | GND | +5V | EB | EA | POT
bPlace: B | EA | EB | +5V | MA | MA | MB | MB | POT | GND | VCC | robotics | PGND | for | A tiny servo controller | MB | MB | MA | MA | GND | +5V | EB | EA | POT | A